# EAGLE schematic LLS16 (EAGLE 9.6.2)
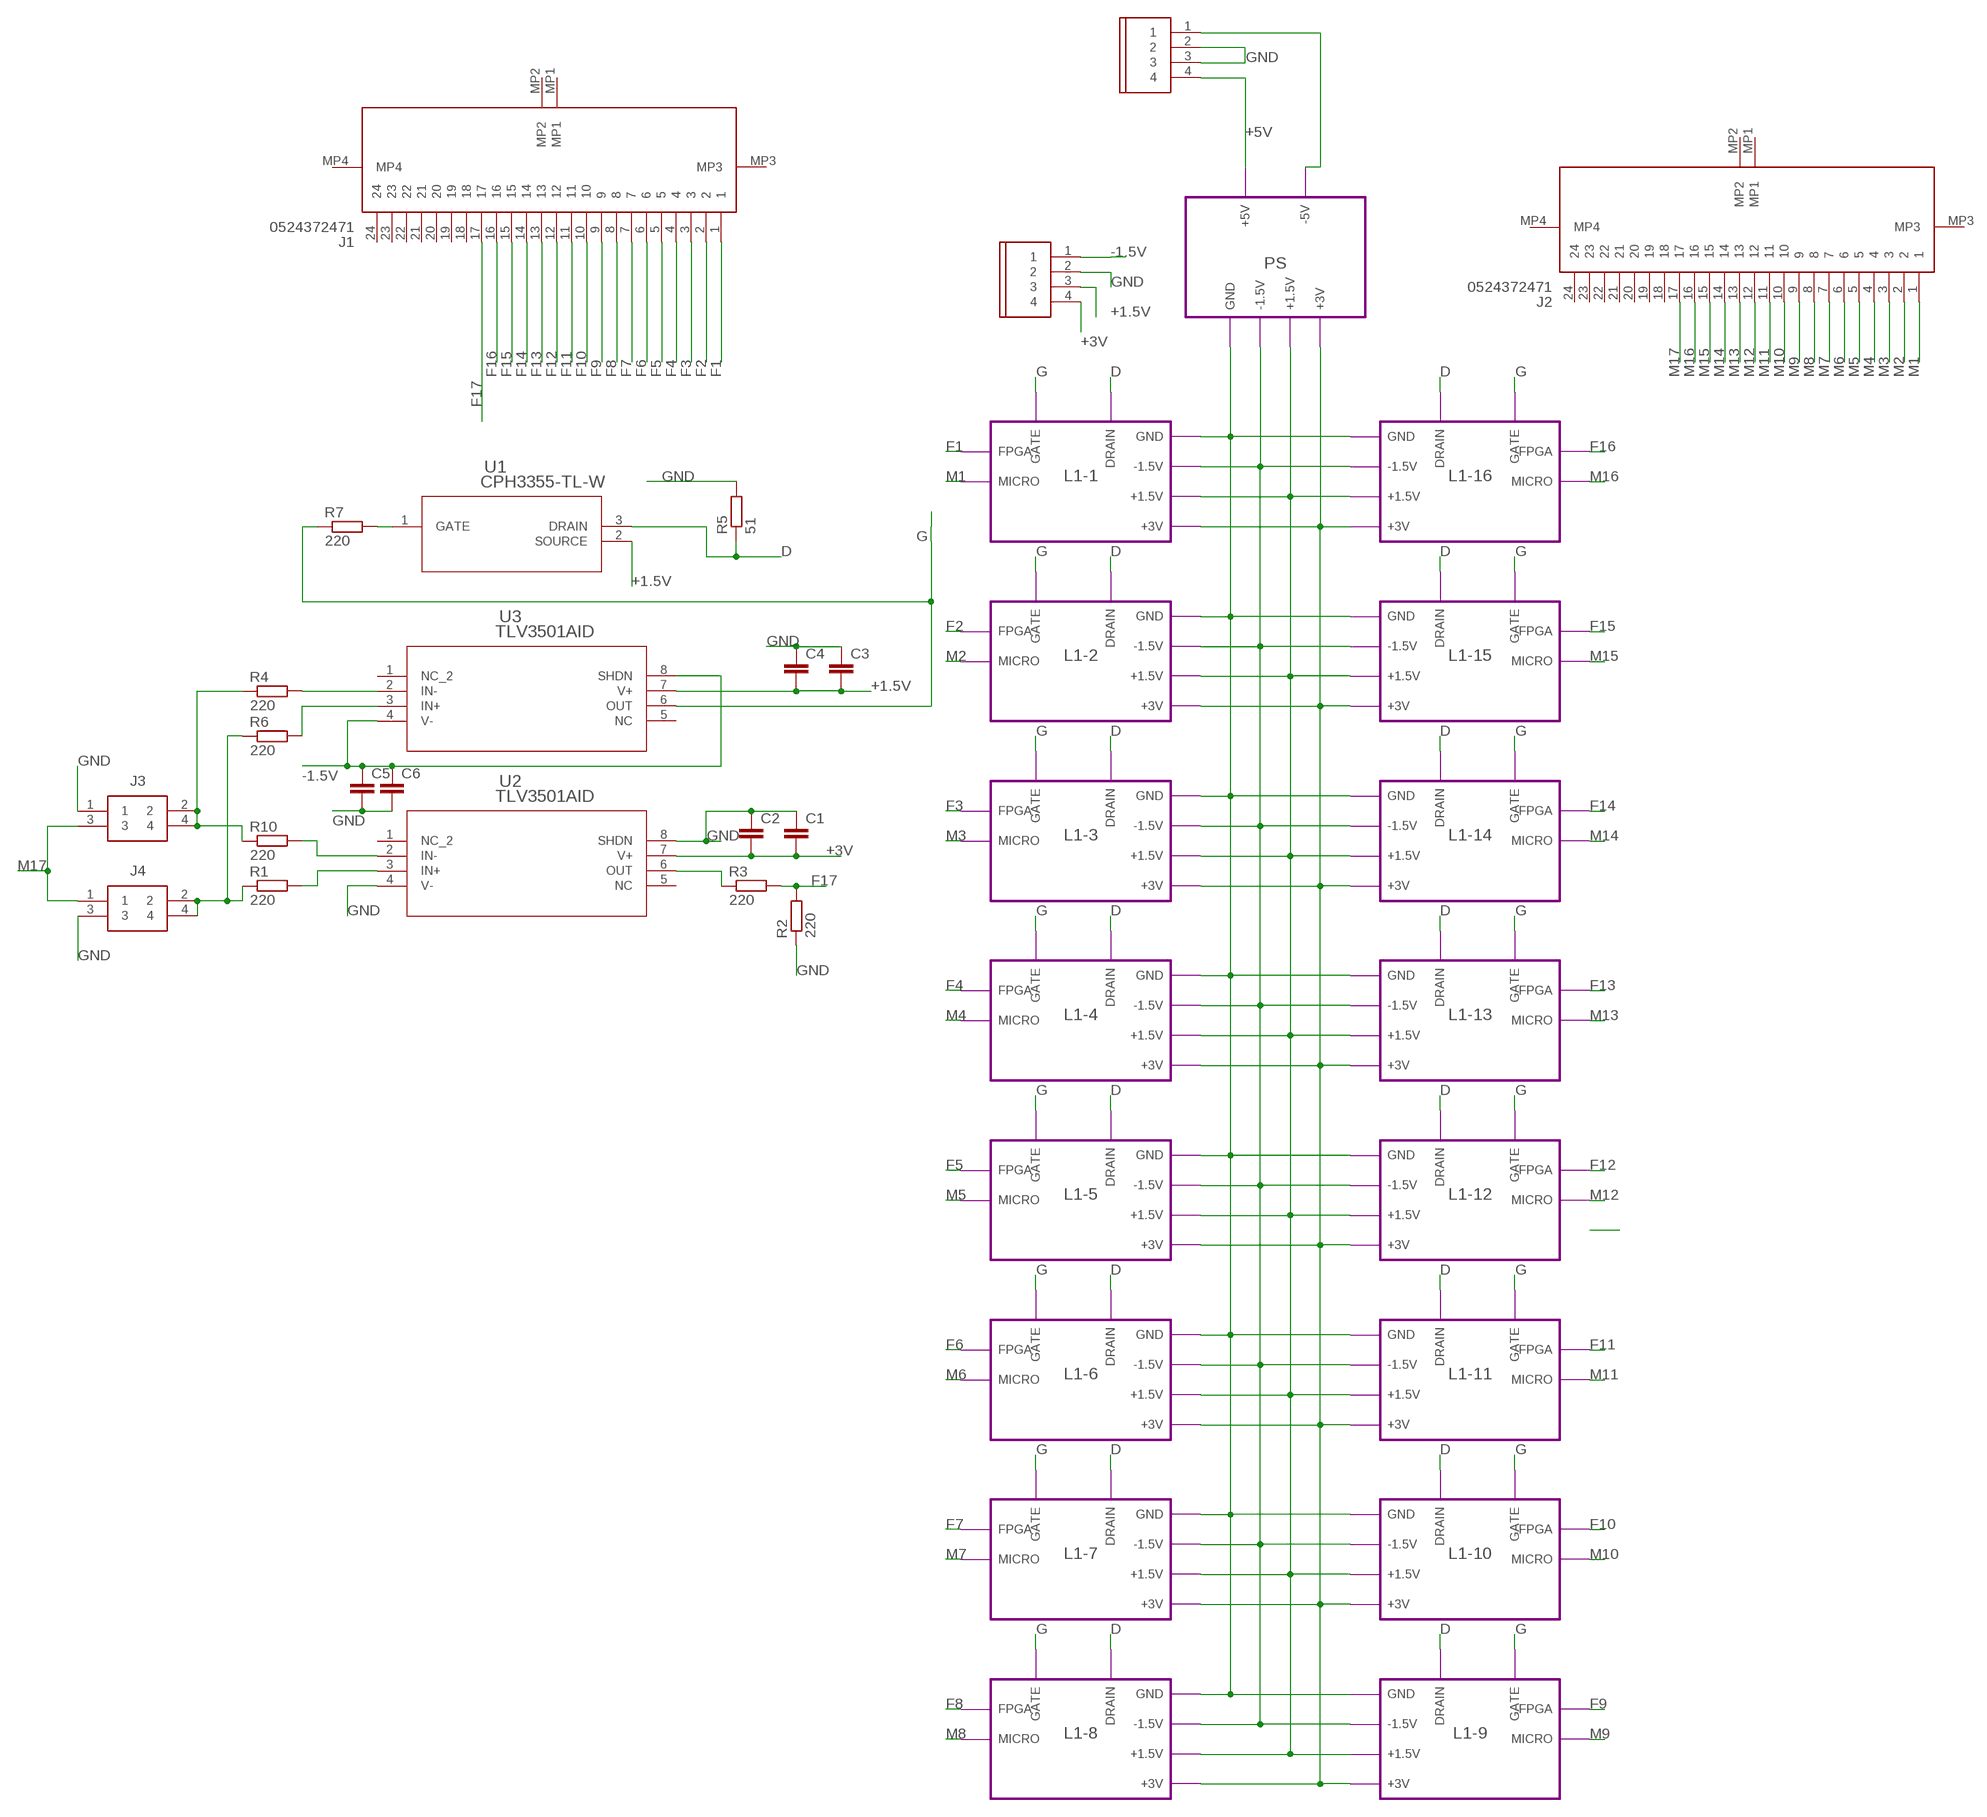
[diagram p0: schematic, sheet 1]

## Parts
C1  C-EUC0805  [C0805]
C2  C-EUC0805  [C0805]
C3  C-EUC0805  [C0805]
C4  C-EUC0805  [C0805]
C5  C-EUC0805  [C0805]
C6  C-EUC0805  [C0805]
J1  0524372471  [0524372471]
J2  0524372471  [0524372471]
J3  70287-1098  [HDRV4W64P254_2X2_521X508X851P]
J4  70287-1098  [HDRV4W64P254_2X2_521X508X851P]
R1  220  R-EU_R0603  [R0603]
R2  220  R-EU_R0603  [R0603]
R3  220  R-EU_R0603  [R0603]
R4  220  R-EU_R0603  [R0603]
R5  51  R-EU_R0805  [R0805]
R6  220  R-EU_R0603  [R0603]
R7  220  R-EU_R0603  [R0603]
R10  220  R-EU_R0603  [R0603]
U1  CPH3355-TL-W  [CPH3_2P9X1P6_ONS]
U2  TLV3501AID  [D8]
U3  TLV3501AID  [D8]
U$1  CONNHEADERVERT4POS2.54MM  [CONNHEADERVERT4POS2.54MM]
U$2  CONNHEADERVERT4POS2.54MM  [CONNHEADERVERT4POS2.54MM]

## Module instances
L1-16 = LOGICLEVELSHIFTER1
L1-15 = LOGICLEVELSHIFTER1
L1-14 = LOGICLEVELSHIFTER1
L1-13 = LOGICLEVELSHIFTER1
L1-12 = LOGICLEVELSHIFTER1
L1-11 = LOGICLEVELSHIFTER1
L1-10 = LOGICLEVELSHIFTER1
L1-9 = LOGICLEVELSHIFTER1
L1-1 = LOGICLEVELSHIFTER1
L1-2 = LOGICLEVELSHIFTER1
L1-3 = LOGICLEVELSHIFTER1
L1-4 = LOGICLEVELSHIFTER1
L1-5 = LOGICLEVELSHIFTER1
L1-6 = LOGICLEVELSHIFTER1
L1-7 = LOGICLEVELSHIFTER1
L1-8 = LOGICLEVELSHIFTER1
PS = POWER

## Nets
+1.5V: C3.2 C4.2 U1.2(SOURCE) U3.7(V+) U$2.3 ; port L1-16.+1.5V L1-9.+1.5V L1-10.+1.5V L1-11.+1.5V L1-12.+1.5V L1-13.+1.5V L1-14.+1.5V L1-15.+1.5V L1-1.+1.5V L1-2.+1.5V L1-3.+1.5V L1-4.+1.5V L1-5.+1.5V L1-6.+1.5V L1-7.+1.5V L1-8.+1.5V PS.+1.5V
+3V: C1.2 C2.2 U2.7(V+) U$2.4 ; port L1-9.+3V L1-16.+3V L1-15.+3V L1-14.+3V L1-13.+3V L1-12.+3V L1-11.+3V L1-10.+3V L1-1.+3V L1-2.+3V L1-3.+3V L1-4.+3V L1-5.+3V L1-6.+3V L1-7.+3V L1-8.+3V PS.+3V
+5V: U$1.4 ; port PS.+5V
-1.5V: C5.1 C6.1 U3.4(V-) U3.8(SHDN) U$2.1 ; port L1-16.-1.5V L1-9.-1.5V L1-15.-1.5V L1-14.-1.5V L1-13.-1.5V L1-12.-1.5V L1-11.-1.5V L1-10.-1.5V L1-1.-1.5V L1-2.-1.5V L1-3.-1.5V L1-4.-1.5V L1-5.-1.5V L1-6.-1.5V L1-7.-1.5V L1-8.-1.5V PS.-1.5V
D: R5.1 U1.3(DRAIN) ; port L1-1.DRAIN L1-16.DRAIN L1-15.DRAIN L1-14.DRAIN L1-13.DRAIN L1-12.DRAIN L1-11.DRAIN L1-10.DRAIN L1-9.DRAIN L1-8.DRAIN L1-7.DRAIN L1-6.DRAIN L1-5.DRAIN L1-4.DRAIN L1-3.DRAIN L1-2.DRAIN
F1: J1.1 ; port L1-1.FPGA
F2: J1.2 ; port L1-2.FPGA
F3: J1.3 ; port L1-3.FPGA
F4: J1.4 ; port L1-4.FPGA
F5: J1.5 ; port L1-5.FPGA
F6: J1.6 ; port L1-6.FPGA
F7: J1.7 ; port L1-7.FPGA
F8: J1.8 ; port L1-8.FPGA
F9: J1.9 ; port L1-9.FPGA
F10: J1.10 ; port L1-10.FPGA
F11: J1.11 ; port L1-11.FPGA
F12: J1.12 ; port L1-12.FPGA
F13: J1.13 ; port L1-13.FPGA
F14: J1.14 ; port L1-14.FPGA
F15: J1.15 ; port L1-15.FPGA
F16: J1.16 ; port L1-16.FPGA
F17: J1.17 R2.2 R3.2
G: R7.1 U3.6(OUT) ; port L1-1.GATE L1-15.GATE L1-16.GATE L1-14.GATE L1-13.GATE L1-12.GATE L1-11.GATE L1-10.GATE L1-9.GATE L1-8.GATE L1-7.GATE L1-6.GATE L1-5.GATE L1-4.GATE L1-3.GATE L1-2.GATE
GND: C1.1 C2.1 C3.1 C4.1 C5.2 C6.2 J3.1 J4.3 R2.1 R5.2 U2.4(V-) U2.8(SHDN) U$1.2 U$1.3 U$2.2 ; port L1-16.GND L1-9.GND L1-15.GND L1-14.GND L1-13.GND L1-12.GND L1-11.GND L1-10.GND L1-1.GND L1-2.GND L1-3.GND L1-4.GND L1-5.GND L1-6.GND L1-7.GND L1-8.GND PS.GND
M1: J2.1 ; port L1-1.MICRO
M2: J2.2 ; port L1-2.MICRO
M3: J2.3 ; port L1-3.MICRO
M4: J2.4 ; port L1-4.MICRO
M5: J2.5 ; port L1-5.MICRO
M6: J2.6 ; port L1-6.MICRO
M7: J2.7 ; port L1-7.MICRO
M8: J2.8 ; port L1-8.MICRO
M9: J2.9 ; port L1-9.MICRO
M10: J2.10 ; port L1-10.MICRO
M11: J2.11 ; port L1-11.MICRO
M12: J2.12 ; port L1-12.MICRO
M13: J2.13 ; port L1-13.MICRO
M14: J2.14 ; port L1-14.MICRO
M15: J2.15 ; port L1-15.MICRO
M16: J2.16 ; port L1-16.MICRO
M17: J2.17 J3.3 J4.1
N$1: R10.2 U2.2(IN-)
N$2: R1.2 U2.3(IN+)
N$3: R3.1 U2.6(OUT)
N$4: R4.2 U3.2(IN-)
N$5: R7.2 U1.1(GATE)
N$6: J4.2 J4.4 R1.1 R6.1
N$7: J3.2 J3.4 R4.1 R10.1
N$8: U$1.1 ; port PS.-5V
N$9: R6.2 U3.3(IN+)
Unconnected: J1.18 J1.19 J1.20 J1.21 J1.22 J1.23 J1.24 J1.MP1 J1.MP2 J1.MP3 J1.MP4 J2.18 J2.19 J2.20 J2.21 J2.22 J2.23 J2.24 J2.MP1 J2.MP2 J2.MP3 J2.MP4 U2.1(NC_2) U2.5(NC) U3.1(NC_2) U3.5(NC)

## Library data of the parts
C1-C6 = rcl:C-EU: CAPACITOR, European symbol; SPICEPREFIX: C
J1 J2 = 0524372471:0524372471: Conn FPC Connector SKT 24 POS 0.5mm Solder RA SMD Easy-On T/R Source: Datasheet <https://www.molex.com/pdm_docs/sd/524372171_sd.pdf>; ARROW_PART_NUMBER: 0524372471; ARROW_PRICE-STOCK: https://www.arrow.com/en/products/0524372471/molex; DESCRIPTION: Conn FPC Connector SKT 24 POS 0.5mm Solder RA SMD Easy-On T/R; HEIGHT: 2.2mm; MANUFACTURER_NAME: Molex; MANUFACTURER_PART_NUMBER: 0524372471; MOUSER_PART_NUMBER: N/A; MOUSER_PRICE-STOCK: https://www.mouser.co.uk/ProductDetail/Molex/0524372471?qs=PBcRNPEHKspMGfgyTEmuOQ%3D%3D
J3 J4 = 70287-1098:70287-1098: Headers & Wire Housings CGrid Bkwy Hdr DR Rt DR RtPn 15''SAu 4Ckt Source: Datasheet <https://www.molex.com/pdm_docs/sd/702871098_sd.pdf>; DESCRIPTION: Headers & Wire Housings CGrid Bkwy Hdr DR Rt DR RtPn 15''SAu 4Ckt; HEIGHT: 8.51mm; MANUFACTURER_NAME: Molex; MANUFACTURER_PART_NUMBER: 70287-1098; MOUSER_PART_NUMBER: 538-70287-1098; MOUSER_PRICE-STOCK: https://www.mouser.co.uk/ProductDetail/Molex/70287-1098?qs=kYQSPAH4sJyJ%2F7vCw3ffjg%3D%3D
R1-R7 R10 = rcl:R-EU_: RESISTOR, European symbol; SPICEPREFIX: R
U1 = CPH3355:CPH3355-TL-W; COPYRIGHT: Copyright (C) 2022 Ultra Librarian. All rights reserved.; DIGI-KEY_PART_NUMBER_1: CPH3355-TL-WOSTR-ND; DIGI-KEY_PART_NUMBER_2: CPH3355-TL-WOSCT-ND; DIGI-KEY_PART_NUMBER_3: CPH3355-TL-WOSDKR-ND; MANUFACTURER_PART_NUMBER: CPH3355-TL-W; MFR_NAME: onsemi
U2 U3 = TLV3501:TLV3501AID; COPYRIGHT: Copyright (C) 2022 Ultra Librarian. All rights reserved.; DIGI-KEY_PART_NUMBER_1: 296-17921-5-ND; DIGI-KEY_PART_NUMBER_2: 2156-TLV3501AID-ND; MANUFACTURER_PART_NUMBER: TLV3501AID; MFR_NAME: Texas Instruments
U$1 U$2 = CONNHEADERVERT4POS2.54MM:CONNHEADERVERT4POS2.54MM

## Module LOGICLEVELSHIFTER1
Ports: +3V(pwr) +1.5V(pwr) -1.5V(pwr) GND(pwr) FPGA(io) MICRO(io) GATE(io) DRAIN(io)
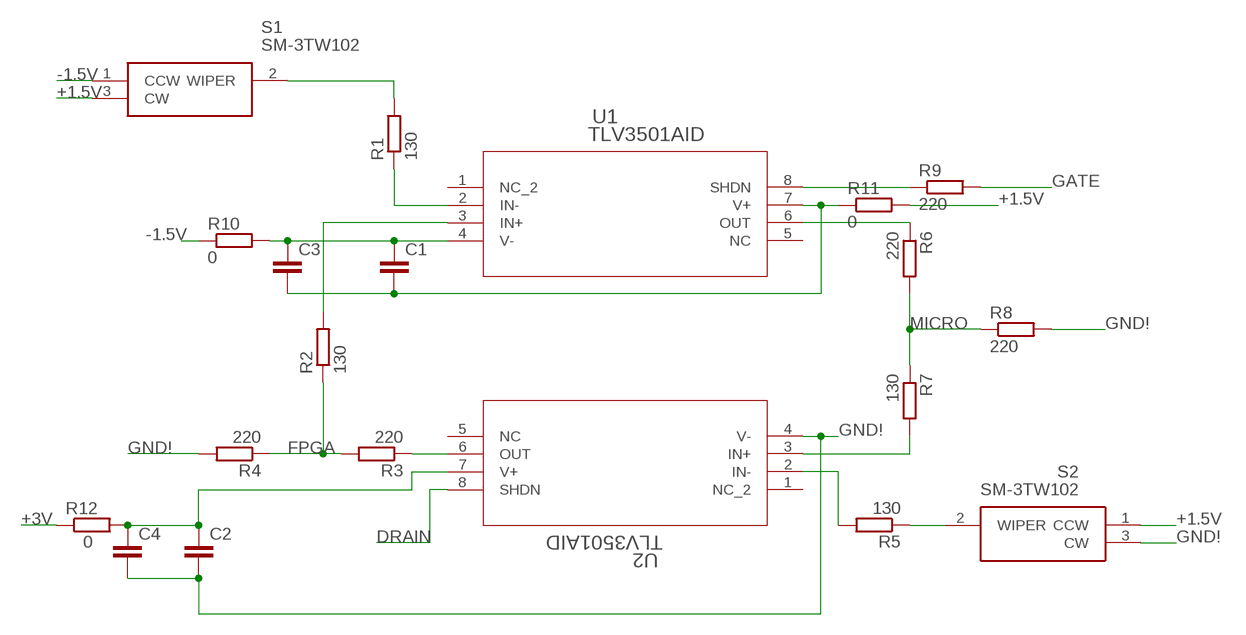
[diagram p1: schematic, module LOGICLEVELSHIFTER1, sheet 1]

### Parts
C1  C-EUC0805  [C0805]
C2  C-EUC0805  [C0805]
C3  C-EUC0805  [C0805]
C4  C-EUC0805  [C0805]
R1  130  R-EU_R0805  [R0805]
R2  130  R-EU_R0603  [R0603]
R3  220  R-EU_R0805  [R0805]
R4  220  R-EU_R0805  [R0805]
R5  130  R-EU_R0805  [R0805]
R6  220  R-EU_R0805  [R0805]
R7  130  R-EU_R0805  [R0805]
R8  220  R-EU_R0805  [R0805]
R9  220  R-EU_R0805  [R0805]
R10  0  R-EU_R0805  [R0805]
R11  0  R-EU_R0805  [R0805]
R12  0  R-EU_R0805  [R0805]
S1  SM-3TW102  [SM3TW102]
S2  SM-3TW102  [SM3TW102]
U1  TLV3501AID  [D8]
U2  TLV3501AID  [D8]

### Nets
+1.5V: R11.2 S1.3(CW) S2.1(CCW)
+3V: R12.1
-1.5V: R10.1 S1.1(CCW)
DRAIN: U2.8(SHDN)
FPGA: R2.1 R3.2 R4.1
GATE: R9.2
GND!: C2.2 C4.2 R4.2 R8.2 S2.3(CW) U2.4(V-)
MICRO: R6.2 R7.1 R8.1
N$1: R1.2 S1.2(WIPER)
N$2: R1.1 U1.2(IN-)
N$3: R2.2 U1.3(IN+)
N$4: C1.1 C3.1 R10.2 U1.4(V-)
N$5: R3.1 U2.6(OUT)
N$6: R5.1 S2.2(WIPER)
N$7: R5.2 U2.2(IN-)
N$8: R7.2 U2.3(IN+)
N$9: C1.2 C3.2 R11.1 U1.7(V+)
N$10: R6.1 U1.6(OUT)
N$11: R9.1 U1.8(SHDN)
N$12: C2.1 C4.1 R12.2 U2.7(V+)
Unconnected: U1.1(NC_2) U1.5(NC) U2.1(NC_2) U2.5(NC)

### Library data of the parts
C1-C4 = rcl:C-EU: CAPACITOR, European symbol; SPICEPREFIX: C
R1-R12 = rcl:R-EU_: RESISTOR, European symbol; SPICEPREFIX: R
S1 S2 = SM-3TW102:SM-3TW102: Trimmer Resistors - SMD 1 KW 3mm SMD multi turn J-lead, top adj., 11 turn Source: Datasheet <https://www.mouser.it/ProductDetail/Nidec-Copal/SM-3TW102/?qs=XeJtXLiO41QfszlUsJazpw==>; DESCRIPTION: Trimmer Resistors - SMD 1 KW 3mm SMD multi turn J-lead, top adj., 11 turn; HEIGHT: 4.5mm; MANUFACTURER_NAME: NIDEC COPAL; MANUFACTURER_PART_NUMBER: SM-3TW102; MOUSER_PART_NUMBER: 229-SM-3TW102; MOUSER_PRICE-STOCK: https://www.mouser.co.uk/ProductDetail/Nidec-Copal/SM-3TW102?qs=XeJtXLiO41QfszlUsJazpw%3D%3D
U1 U2 = TLV3501:TLV3501AID; COPYRIGHT: Copyright (C) 2022 Ultra Librarian. All rights reserved.; DIGI-KEY_PART_NUMBER_1: 296-17921-5-ND; DIGI-KEY_PART_NUMBER_2: 2156-TLV3501AID-ND; MANUFACTURER_PART_NUMBER: TLV3501AID; MFR_NAME: Texas Instruments

## Module POWER
Ports: GND(out) -1.5V(out) +1.5V(out) +3V(out) +5V(pwr) -5V(pwr)
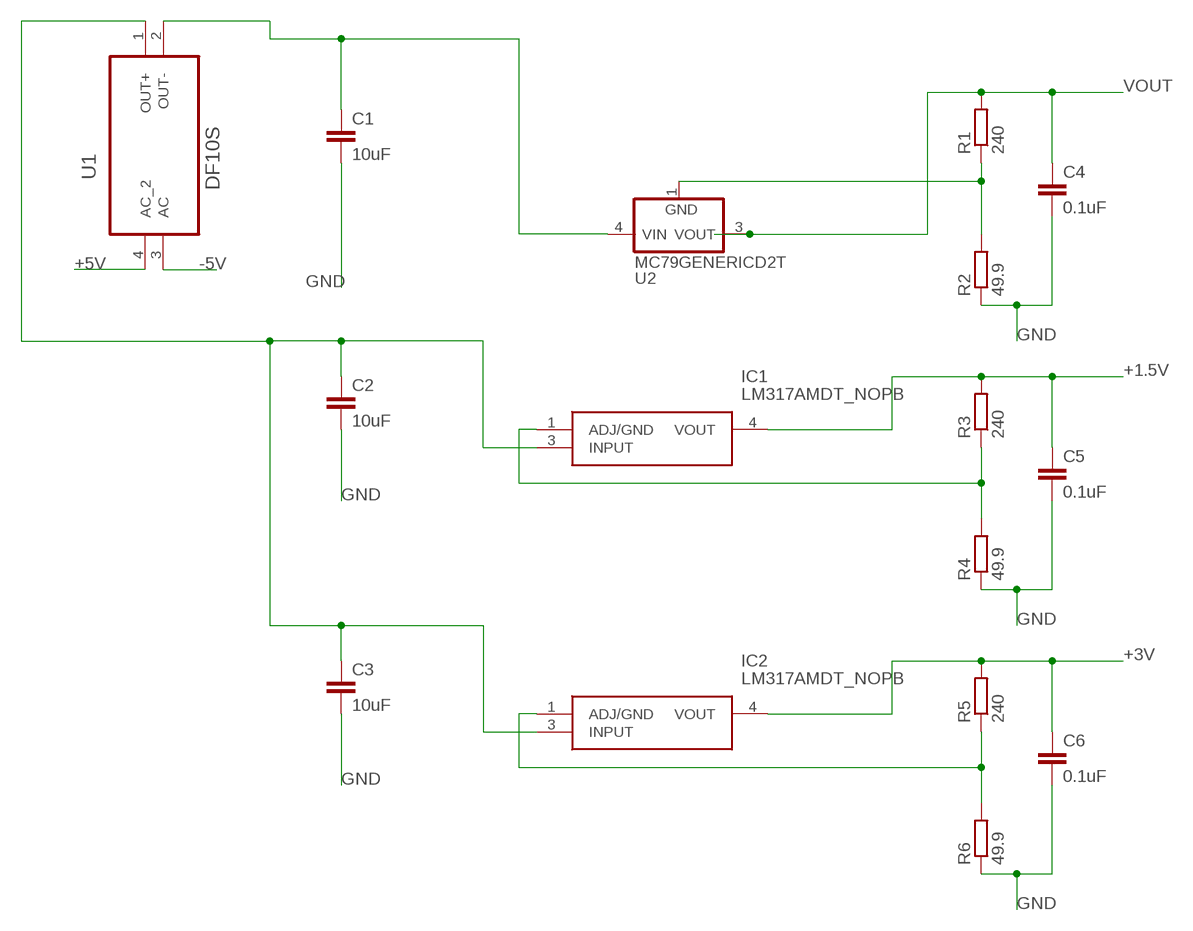
[diagram p2: schematic, module POWER, sheet 1]

### Parts
C1  10uF  C-EUC0805  [C0805]
C2  10uF  C-EUC0805  [C0805]
C3  10uF  C-EUC0805  [C0805]
C4  0.1uF  C-EUC0805  [C0805]
C5  0.1uF  C-EUC0805  [C0805]
C6  0.1uF  C-EUC0805  [C0805]
IC1  LM317AMDT_NOPB  [TO228P991X238-3N]
IC2  LM317AMDT_NOPB  [TO228P991X238-3N]
R1  240  R-EU_R0603  [R0603]
R2  49.9  R-EU_R0603  [R0603]
R3  240  R-EU_R0603  [R0603]
R4  49.9  R-EU_R0603  [R0603]
R5  240  R-EU_R0603  [R0603]
R6  49.9  R-EU_R0603  [R0603]
U1  DF10S  [SOT508P985X260-4N]
U2  MC79GENERICD2T  [D2PAK-3]

### Nets
+1.5V: C5.1 IC1.4(VOUT) R3.2
+3V: C6.1 IC2.4(VOUT) R5.2
+5V: U1.4(AC_2)
-5V: U1.3(AC)
GND: C1.2 C2.2 C3.2 C4.2 C5.2 C6.2 R2.1 R4.1 R6.1
N$1: C1.1 U1.2(OUT-) U2.4(VIN)
N$2: C2.1 C3.1 IC1.3(INPUT) IC2.3(INPUT) U1.1(OUT+)
N$3: IC2.1(ADJ/GND) R5.1 R6.2
N$4: R1.1 R2.2 U2.1(GND)
N$5: IC1.1(ADJ/GND) R3.1 R4.2
VOUT: C4.1 R1.2 U2.3(VOUT)

### Library data of the parts
C1-C6 = rcl:C-EU: CAPACITOR, European symbol; SPICEPREFIX: C
IC1 IC2 = LM317AMDT_NOPB:LM317AMDT_NOPB: 1% Accurate, 1.5A Adjustable Linear Regulator with Short Circuit Protection Source: Datasheet <http://www.ti.com/lit/ds/symlink/lm317-n.pdf>; DESCRIPTION: 1% Accurate, 1.5A Adjustable Linear Regulator with Short Circuit Protection; HEIGHT: 2.38mm; MANUFACTURER_NAME: Texas Instruments; MANUFACTURER_PART_NUMBER: LM317AMDT/NOPB; MOUSER_PART_NUMBER: 926-LM317AMDT/NOPB; MOUSER_PRICE-STOCK: https://www.mouser.co.uk/ProductDetail/Texas-Instruments/LM317AMDT-NOPB?qs=X1J7HmVL2ZHvM%2FHpkMbGJg%3D%3D
R1-R6 = rcl:R-EU_: RESISTOR, European symbol; SPICEPREFIX: R
U1 = DF10S:DF10S: Bridge Rectifiers; DESCRIPTION: Bridge Rectifier Single Phase Standard 1 kV Surface Mount 4-SDIP; DIGI-KEY_PART_NUMBER: DF10STR-ND; MF: ON; MP: DF10S; PACKAGE: SMD-4 ON; PURCHASE-URL: https://pricing.snapeda.com/search/part/DF10S/?ref=eda
U2 = _hhn_78xx_79xx_NCV78xx_d2pak_dpak:MC79*: 79xx SMD (D2PAK) (MC)79xx..D2T (D2PAK-3; Rth,JA = 45 K/W @ 10x10mm copper area) Linear Voltage Regulators, Negative, 1 A (ON Semiconductor) Package dimenisions and soldering footprints acc. to ONSEMI specs. Source: http://onsemi.com Datasheet document#: MC7900/D Technologies: 79xxyD2Tz: xx = Output Voltage (V) y, z: additional suffixes see manufacturer's datasheet Author: Dipl.-Ing. FH Rainer Bayer HHN Hochschule Heilbronn, rainer.bayer@hs-heilbronn.de Ingenieurbüro ing-rb, mail@ing-rb.de

## Module DIRECTION
Ports: 

### Library data of the parts